# Altium schematic sheet EndEffector- Connectors.SchDoc
size A4
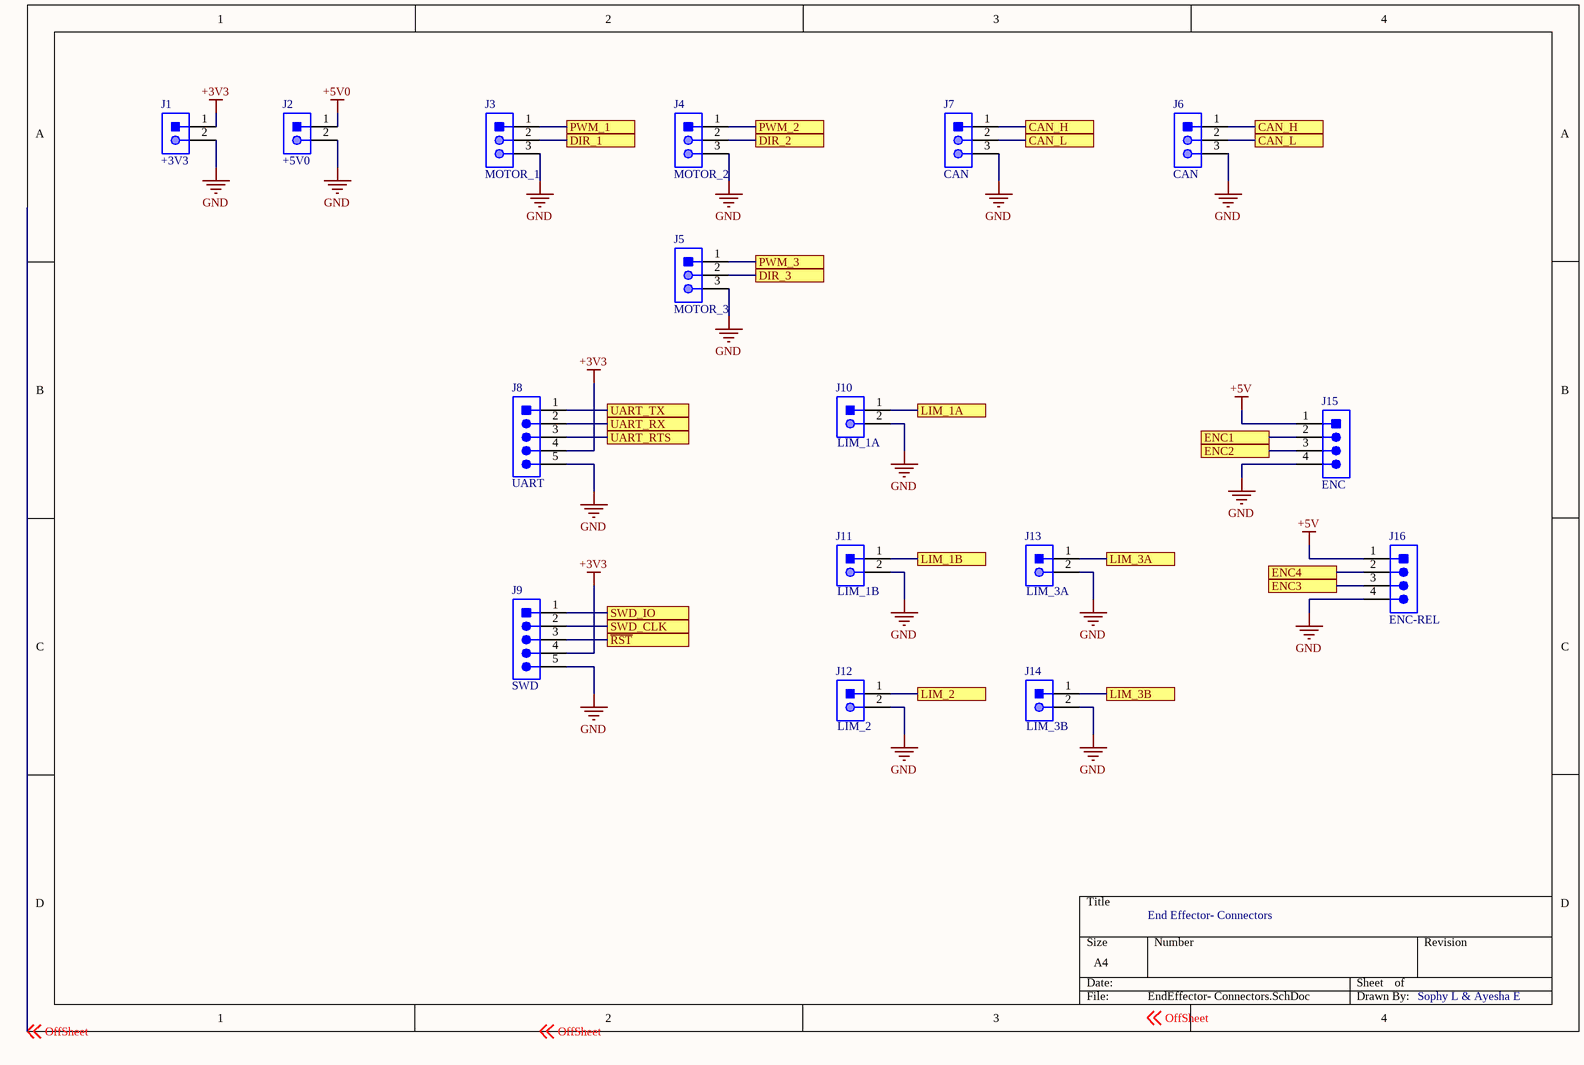
[diagram p0: EndEffector- Connectors.SchDoc]

## Parts
J1  +3V3
J2  +5V0
J3  MOTOR_1
J4  MOTOR_2
J5  MOTOR_3
J6  CAN
J7  CAN
J8  UART
J9  SWD
J10  LIM_1A
J11  LIM_1B
J12  LIM_2
J13  LIM_3A
J14  LIM_3B
J15  ENC
J16  ENC-REL

## Ports
CAN_H, CAN_L, DIR_1, DIR_2, DIR_3, ENC1, ENC2, ENC3, ENC4, LIM_1A, LIM_1B, LIM_2, LIM_3A, LIM_3B, PWM_1, PWM_2, PWM_3, SWD_CLK, SWD_IO, UART_RTS, UART_RX, UART_TX, ~{RST}

## Nets
+3V3: J1.1 J8.4 J9.4
+5V: J15.1 J16.1
+5V0: J2.1
GND: J1.2 J2.2 J3.3 J4.3 J5.3 J6.3 J7.3 J8.5 J9.5 J10.2 J11.2 J12.2 J13.2 J14.2 J15.4 J16.4
~{RST}: J9.3 ; port ~{RST}
CAN_H: J6.1 J7.1 ; port CAN_H
CAN_L: J6.2 J7.2 ; port CAN_L
DIR_1: J3.2 ; port DIR_1
DIR_2: J4.2 ; port DIR_2
DIR_3: J5.2 ; port DIR_3
ENC1: J15.2 ; port ENC1
ENC2: J15.3 ; port ENC2
ENC3: J16.3 ; port ENC3
ENC4: J16.2 ; port ENC4
LIM_1A: J10.1 ; port LIM_1A
LIM_1B: J11.1 ; port LIM_1B
LIM_2: J12.1 ; port LIM_2
LIM_3A: J13.1 ; port LIM_3A
LIM_3B: J14.1 ; port LIM_3B
PWM_1: J3.1 ; port PWM_1
PWM_2: J4.1 ; port PWM_2
PWM_3: J5.1 ; port PWM_3
SWD_CLK: J9.2 ; port SWD_CLK
SWD_IO: J9.1 ; port SWD_IO
UART_RTS: J8.3 ; port UART_RTS
UART_RX: J8.2 ; port UART_RX
UART_TX: J8.1 ; port UART_TX

## Notes on the sheet
- End Effector- Connectors
- Sophy L & Ayesha E
- Labels drawn without touching a wire or pin: OffSheet

## Library data of the parts
J1 J2 J10-J14 = CON_2M_PH_SIDE_SMT: CONN HEADER PH SIDE 2POS 2MM SMD; Manufacturer: JST; Part Number: S2B-PH-SM4-TB; ComponentLink1Description: Datasheet; ComponentLink1URL: http://www.jst-mfg.com/product/pdf/eng/ePH.pdf
J3-J7 = CON_3M_PH_SIDE_SMT: CONN HEADER PH SIDE 3POS 2MM SMD; Manufacturer: JST; Part Number: B3B-PH-SM4-TB; ComponentLink1Description: Datasheet; ComponentLink1URL: http://www.jst-mfg.com/product/pdf/eng/ePH.pdf
J8 J9 = CON_5M_PH_SIDE_TH: CONN HEADER PH SIDE 5POS 2MM; Manufacturer: JST; Part Number: S5B-PH-K-S; ComponentLink1Description: Datasheet; ComponentLink1URL: http://www.jst-mfg.com/product/pdf/eng/ePH.pdf
J15 J16 = CON_4M_PH_SIDE_SMT: CONN HEADER PH SIDE 4POS 2MM SMD; Manufacturer: JST; Part Number: B4B-PH-SM4-TB; ComponentLink1Description: Datasheet; ComponentLink1URL: http://www.jst-mfg.com/product/pdf/eng/ePH.pdf